# Altium schematic sheet ArduinoLeonard.SchDoc
size A4; PageSetup: Record=PageOptions|CenterHorizontal=True|CenterVertical=True|PrintScale=0.97|XCorrection=1.00|YCorrection=1.00|PrintKind=0|BorderSize=5000000|LeftOffset=0|BottomOffset=0|Orientation=2|PaperLength=1000|PaperWidth=1000|Scale=100|PaperSource=278|PrintQuality=-3|MediaType=1|DitherType=10|PrintScaleMode=1|PaperKind=A4|PaperIndex=9
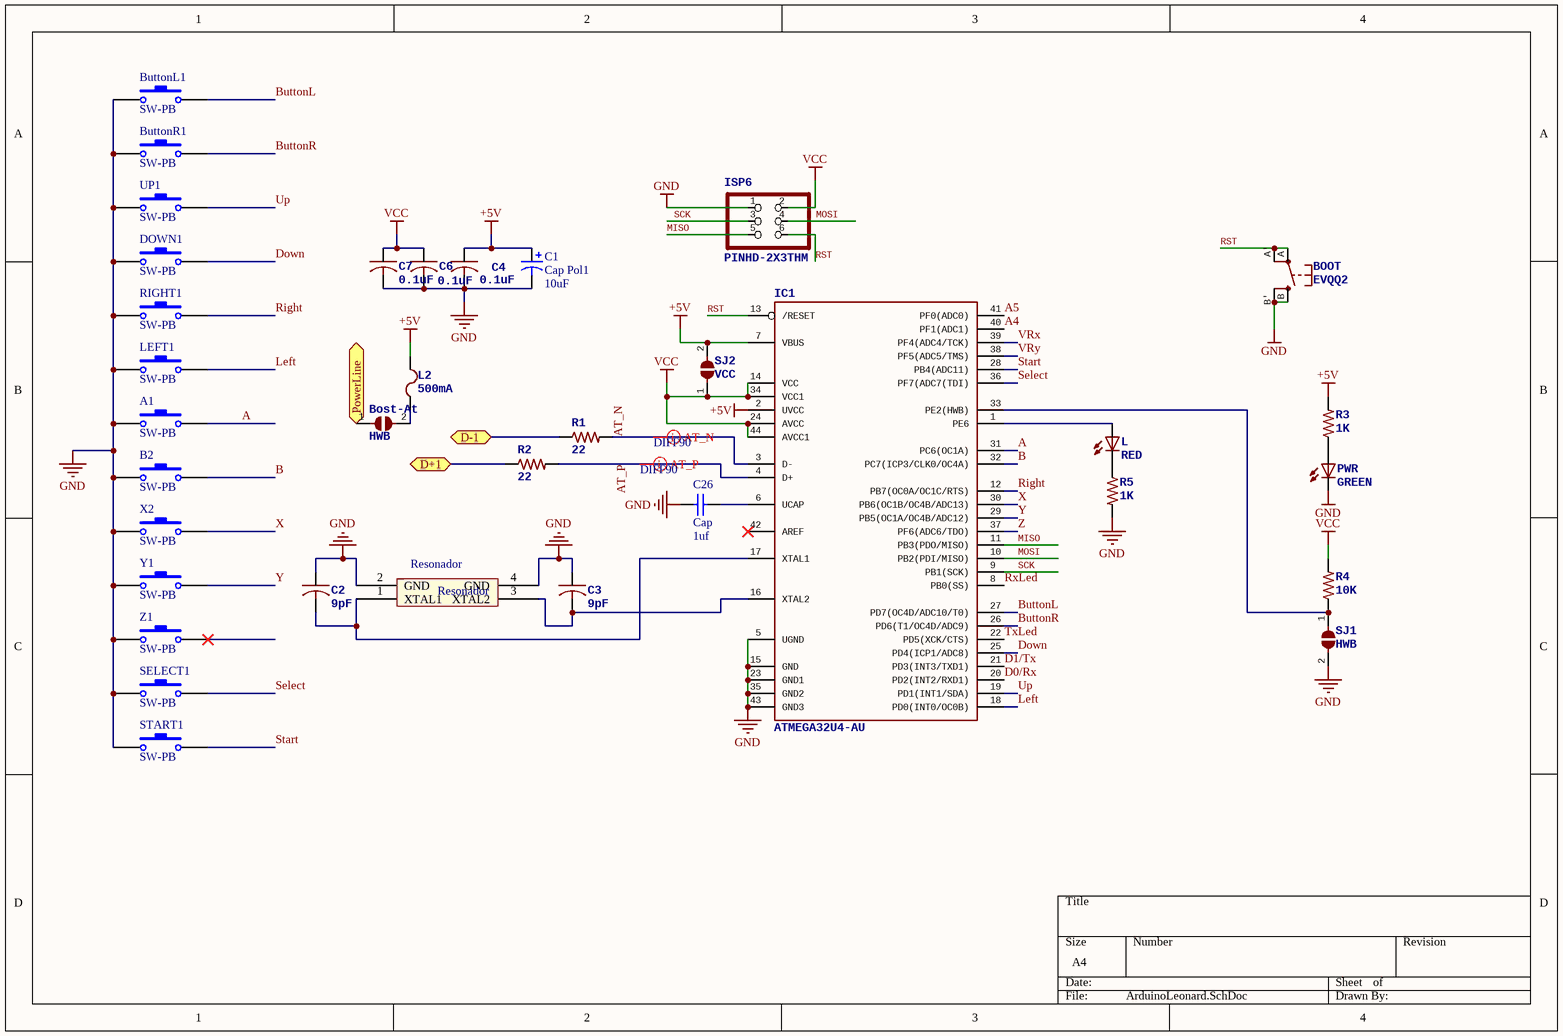
[diagram p0: ArduinoLeonard.SchDoc]

## Parts
A1  SW-PB  [DMG-BTN]
B2  SW-PB  [DMG-BTN]
BOOT  EVQQ2  [EVQ-Q2]
Bost-At  HWB  [JUMPER]
ButtonL1  SW-PB  [1X02_OVAL]
ButtonR1  SW-PB  [1X02_OVAL]
C1  Cap Pol1  value 10uF  [RES-1206in]
C2  9pF  [1608[0603]]
C3  9pF  [1608[0603]]
C4  0.1uF  [1608[0603]]
C6  0.1uF  [1608[0603]]
C7  0.1uF  [1608[0603]]
C26  Cap  value 1uf  [0805]
DOWN1  SW-PB  [DMG-BTN]
IC1  ATMEGA32U4-AU  [TQFP44]
ISP6  PINHD-2X3THM  [1X06_OVAL]
L  RED  [CHIPLED_0805]
L2  500mA  [RES-1206in]
LEFT1  SW-PB  [DMG-BTN]
PWR  GREEN  [CHIPLED_0805]
R1  22  [0603]
R2  22  [0603]
R3  1K  [RES-1206in]
R4  10K  [RES-1206in]
R5  1K  [RES-1206in]
RIGHT1  SW-PB  [DMG-BTN]
SELECT1  SW-PB  [DMG-SEL]
SJ1  HWB  [JUMPER]
SJ2  VCC  [JUMPER]
START1  SW-PB  [DMG-ST]
UP1  SW-PB  [DMG-BTN]
X2  SW-PB  [DMG-BTN -XY]
X4  SMD-CRYSTAL-16MHZ-9PF-Resonador  [Resonador3.2x2.5]  (value not drawn)
Y1  SW-PB  [DMG-BTN -XY]
Z1  SW-PB  [DMG-BTN -XY]

## Ports
D+1, D-1, PowerLine

## Nets
+5V: C1.1 C4.1 IC1.2(UVCC) IC1.7(VBUS) L2.2 R3.2 SJ2.2
GND: A1.1 B2.1 BOOT.B(S) BOOT.B'(S1) ButtonL1.1 ButtonR1.1 C1.2 C2.1 C3.1 C4.2 C6.2 C7.2 C26.1 DOWN1.1 IC1.5(UGND) IC1.15(GND) IC1.23(GND1) IC1.35(GND2) IC1.43(GND3) ISP6.1 LEFT1.1 PWR.C R5.2 RIGHT1.1 SELECT1.1 SJ1.2 START1.1 UP1.1 X2.1 X4.2(GND) X4.4(GND) Y1.1 Z1.1
VCC: C6.1 C7.1 IC1.14(VCC) IC1.24(AVCC) IC1.34(VCC1) IC1.44(AVCC1) ISP6.2 R4.2 SJ2.1
A: A1.2 IC1.31(PC6(OC1A))
A4: IC1.40(PF1(ADC1))
A5: IC1.41(PF0(ADC0))
AT_N: IC1.3(D-) R1.2
AT_P: IC1.4(D+) R2.2
B: B2.2 IC1.32(PC7(ICP3/CLK0/OC4A))
ButtonL: ButtonL1.2 IC1.27(PD7(OC4D/ADC10/T0))
ButtonR: ButtonR1.2 IC1.26(PD6(T1/OC4D/ADC9))
D0/Rx: IC1.20(PD2(INT2/RXD1))
D1/Tx: IC1.21(PD3(INT3/TXD1))
D+1: R2.1 ; port D+1
D-1: R1.1 ; port D-1
Down: DOWN1.2 IC1.25(PD4(ICP1/ADC8))
Left: IC1.18(PD0(INT0/OC0B)) LEFT1.2
MISO: IC1.11(PB3(PDO/MISO)) ISP6.5
MOSI: IC1.10(PB2(PDI/MISO)) ISP6.4
PowerLine: Bost-At.1 ; port PowerLine
Right: IC1.12(PB7(OC0A/OC1C/RTS)) RIGHT1.2
RST: BOOT.A(P) BOOT.A'(P1) IC1.13(/RESET) ISP6.6
RxLed: IC1.8(PB0(SS))
SCK: IC1.9(PB1(SCK)) ISP6.3
Select: IC1.36(PF7(ADC7(TDI)) SELECT1.2
Start: IC1.28(PB4(ADC11)) START1.2
TxLed: IC1.22(PD5(XCK/CTS))
Up: IC1.19(PD1(INT1/SDA)) UP1.2
VRx: IC1.39(PF4(ADC4/TCK))
VRy: IC1.38(PF5(ADC5/TMS))
X: IC1.30(PB6(OC1B/OC4B/ADC13)) X2.2
Y: IC1.29(PB5(OC1A/OC4B/ADC12)) Y1.2
Z: IC1.37(PF6(ADC6/TDO))
NetBost-At_2: Bost-At.2 L2.1
NetC2_2: C2.2 IC1.17(XTAL1) X4.1(XTAL1)
NetC3_2: C3.2 IC1.16(XTAL2) X4.3(XTAL2)
NetC26_2: C26.2 IC1.6(UCAP)
NetIC1_1: IC1.1(PE6) L.A
NetIC1_33: IC1.33(PE2(HWB)) R4.1 SJ1.1
NetL_C: L.C R5.1
NetPWR_A: PWR.A R3.1

Not connected (* = marked no-connect by the designer): IC1 42(AREF)*; Z1 2*

## Layout directives
differential pair; net class DIFF90: AT_N, AT_P

## Notes on the sheet
- (in symbol SMD-CRYSTAL-16MHZ-9PF-10PPM-60R(4P-3.2X2.5MM)) Resonador

## Library data of the parts
A1 B2 ButtonL1 ButtonR1 DOWN1 LEFT1 RIGHT1 SELECT1 START1 UP1 X2 Y1 Z1 = SW-PB: Switch; Published: 24-Mar-1999; LatestRevisionDate: 17-Jul-2002; LatestRevisionNote: Re-released for DXP Platform.; PackageReference: SPST-2; Publisher: Altium Limited; PackageDescription: Switch; 2 Leads
Bost-At SJ1 SJ2 = SJ: SMD solder JUMPER
C1 = Cap Pol1: Polarized Capacitor (Radial); Published: 8-Jun-2000; LatestRevisionDate: 17-Jul-2002; LatestRevisionNote: Re-released for DXP Platform.; PackageReference: RB7.6-15; Publisher: Altium Limited; PackageDescription: Polarized Capacitor (Radial); 2 Leads
C2-C4 C6 C7 = C-USC0805K: CAPACITOR, American symbol
C26 = Cap: Capacitor; Published: 8-Jun-2000; LatestRevisionDate: 17-Jul-2002; LatestRevisionNote: Re-released for DXP Platform.; PackageReference: RAD-0.3; Publisher: Altium Limited; PackageDescription: Radial Cap, Thru-Hole; 2 Leads; 0.3 in Pin Spacing
L PWR = LEDCHIPLED_0805: LED   OSRAM: - CHIPLED LG R971, LG N971, LY N971, LG Q971, LY Q971, LO R971, LY R971 LH N974, LH R974 LS Q976, LO Q976, LY Q976 LO Q996 - Hyper CHIPLED LW Q18S LB Q993, LB Q99A, LB R99A - SideLED LS A670, LO A670, LY A670, LG A670, LP A670 LB A673, LV A673, LT A673, LW A673 LH A674 LY A675 LS A676, LA A676, LO A676, LY A676, LW A676 LS A679, LY A679, LG A679 -  Hyper Micro SIDELED® LS Y876, LA Y876, LO Y876, LY Y876 LT Y87S - SmartLED LW L88C, LW L88S LB L89C, LB L89S, LG L890 LS L89K, LO L89K, LY L89K LS L896, LA L896, LO L896, LY L896 - TOPLED LS T670, LO T670, LY T670, LG T670, LP T670 LSG T670, LSP T670, LSY T670, LOP T670, LYG T670 LG T671, LOG T671, LSG T671 LB T673, LV T673, LT T673, LW T673 LH T674 LS T676, LA T676, LO T676, LY T676, LB T676, LH T676, LSB T676, LW T676 LB T67C, LV T67C, LT T67C, LS T67K, LO T67K, LY T67K, LW E67C LS E67B, LA E67B, LO E67B, LY E67B, LB E67C, LV E67C, LT E67C LW T67C LS T679, LY T679, LG T679 LS T770, LO T770, LY T770, LG T770, LP T770 LB T773, LV T773, LT T773, LW T773 LH T774 LS E675, LA E675, LY E675, LS T675 LS T776, LA T776, LO T776, LY T776, LB T776 LHGB T686 LT T68C, LB T68C - Hyper Mini TOPLED® LB M676 - Mini TOPLED Santana® LG M470 LS M47K, LO M47K, LY M47K    Source: http://www.osram.convergy.de/
L2 = PTCFUSE-1206: PTC fuses, resettable thermistors
R1-R5 = R-US_R0805: RESISTOR, American symbol
X4 = SMD-CRYSTAL-16MHZ-9PF-10PPM-60R(4P-3.2X2.5MM): SMD Crystal 16MHz-9pF-10ppm-60R;; MF: Epson; MP: TSX-3225 16.0000MF18X-AC3; Package: 1210 Epson; Price: 0.38 USD; Availability: Bad; Value: *